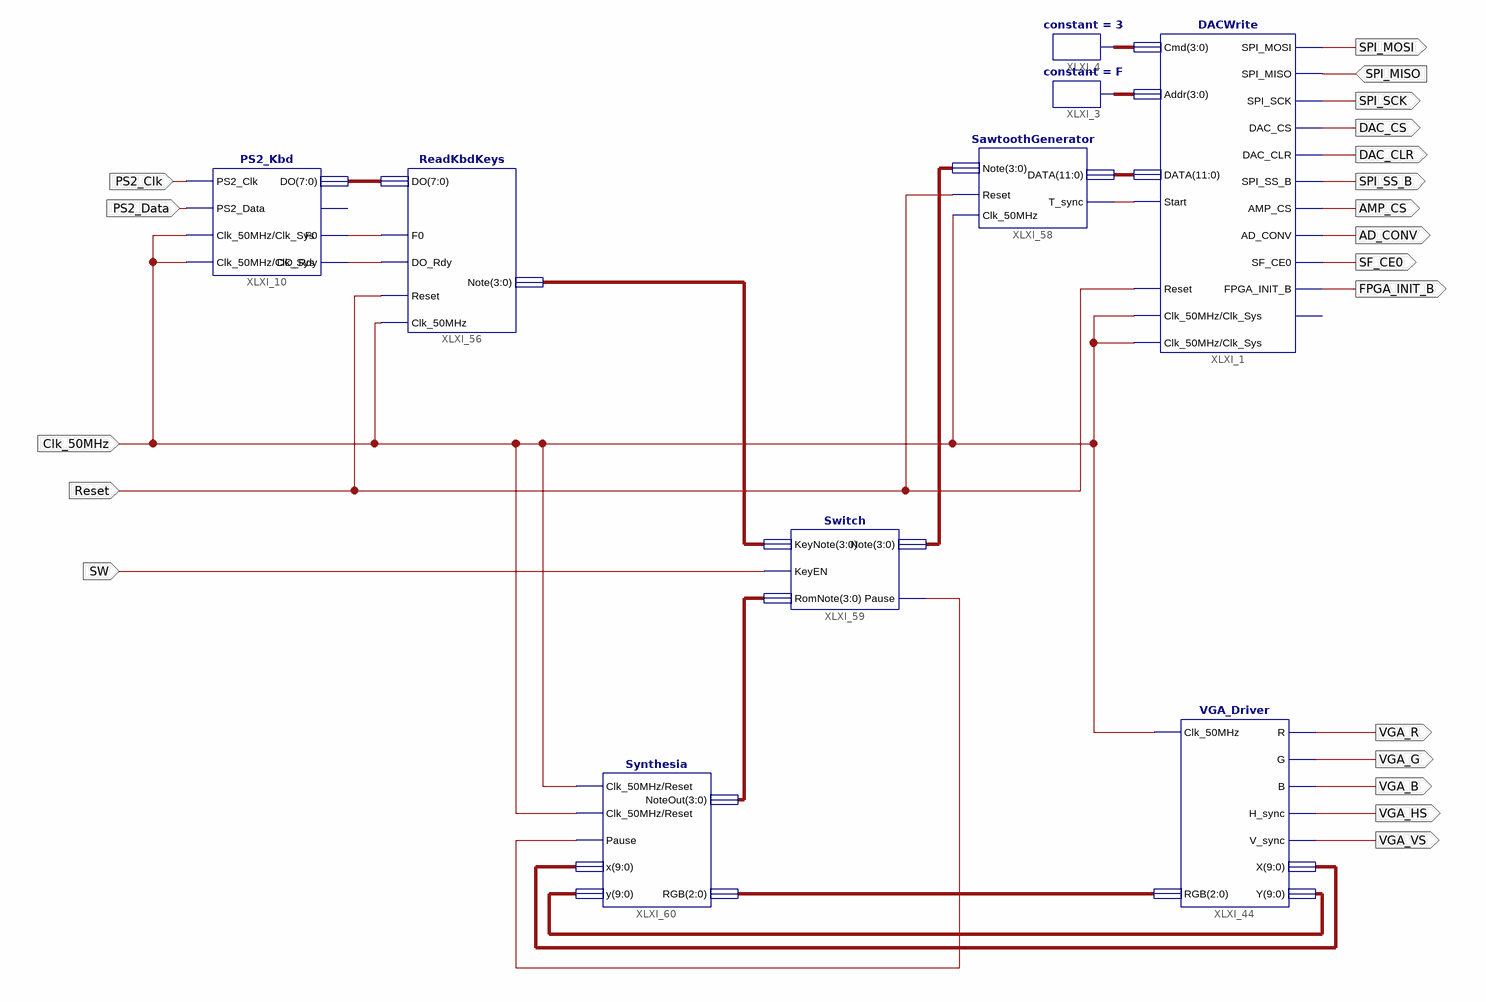
[diagram p0: schematic sheet 1]
// Xilinx ISE schematic Schemat.sch (spartan3e) as structural Verilog: 9 symbols, 20 ports
module Schemat (
  input  SW,
  input  SPI_MISO,
  input  PS2_Data,
  input  PS2_Clk,
  input  Reset,
  input  Clk_50MHz,
  output VGA_VS,
  output VGA_HS,
  output VGA_B,
  output VGA_G,
  output VGA_R,
  output FPGA_INIT_B,
  output SF_CE0,
  output AD_CONV,
  output AMP_CS,
  output SPI_SS_B,
  output DAC_CLR,
  output DAC_CS,
  output SPI_SCK,
  output SPI_MOSI
);

  wire XLXN_287, XLXN_289, XLXN_290, XLXN_300;
  wire [2:0] XLXN_291;
  wire [3:0] XLXN_181, XLXN_182, XLXN_298, XLXN_301, XLXN_302;
  wire [7:0] XLXN_288;
  wire [9:0] XLXN_292, XLXN_293;
  wire [11:0] XLXN_286;

  VGA_Driver XLXI_44 (
    .Clk_50MHz(Clk_50MHz), .RGB(XLXN_291), .R(VGA_R), .G(VGA_G), .B(VGA_B), .H_sync(VGA_HS), .V_sync(VGA_VS),
    .X(XLXN_293), .Y(XLXN_292));
  constant #(.CValue("3")) XLXI_4 (.O(XLXN_182));
  constant #(.CValue("F")) XLXI_3 (.O(XLXN_181));
  DACWrite XLXI_1 (
    .Reset(Reset), .SPI_MISO(SPI_MISO), .DAC_CLR(DAC_CLR), .DAC_CS(DAC_CS), .SPI_MOSI(SPI_MOSI),
    .SPI_SCK(SPI_SCK), .SPI_SS_B(SPI_SS_B), .AMP_CS(AMP_CS), .AD_CONV(AD_CONV), .SF_CE0(SF_CE0),
    .FPGA_INIT_B(FPGA_INIT_B), .Clk_50MHz(Clk_50MHz), .Clk_Sys(Clk_50MHz), .Cmd(XLXN_182), .DATA(XLXN_286),
    .Start(XLXN_287), .Addr(XLXN_181));  // open: Busy
  PS2_Kbd XLXI_10 (
    .PS2_Clk(PS2_Clk), .PS2_Data(PS2_Data), .Clk_50MHz(Clk_50MHz), .F0(XLXN_289), .DO_Rdy(XLXN_290),
    .DO(XLXN_288), .Clk_Sys(Clk_50MHz));  // open: E0
  ReadKbdKeys XLXI_56 (
    .Reset(Reset), .Clk_50MHz(Clk_50MHz), .DO(XLXN_288), .F0(XLXN_289), .DO_Rdy(XLXN_290), .Note(XLXN_302));
  SawtoothGenerator XLXI_58 (.Note(XLXN_301), .Reset(Reset), .Clk_50MHz(Clk_50MHz), .DATA(XLXN_286), .T_sync(XLXN_287));
  Switch XLXI_59 (.KeyEN(SW), .Pause(XLXN_300), .Note(XLXN_301), .KeyNote(XLXN_302), .RomNote(XLXN_298));
  Synthesia XLXI_60 (
    .Clk_50MHz(Clk_50MHz), .Reset(Clk_50MHz), .Pause(XLXN_300), .x(XLXN_293), .y(XLXN_292),
    .NoteOut(XLXN_298), .RGB(XLXN_291));
endmodule
